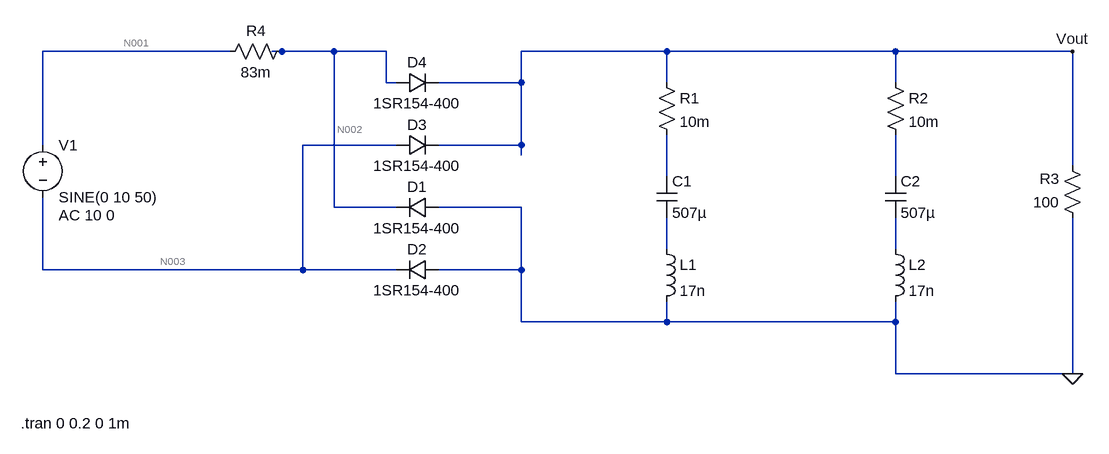
[diagram p0: schematic MuE_Set_1.asc]
MuE_Set_1.asc, the LTspice schematic file:
Version 4
SHEET 1 880 680
WIRE -576 -64 -864 -64
WIRE -496 -64 -512 -64
WIRE -416 -64 -496 -64
WIRE -336 -64 -416 -64
WIRE 96 -64 -128 -64
WIRE 448 -64 96 -64
WIRE 720 -64 448 -64
WIRE -336 -16 -336 -64
WIRE -320 -16 -336 -16
WIRE -128 -16 -128 -64
WIRE -128 -16 -256 -16
WIRE 96 -16 96 -64
WIRE 448 -16 448 -64
WIRE -864 80 -864 -64
WIRE -320 80 -464 80
WIRE -128 80 -128 -16
WIRE -128 80 -256 80
WIRE -128 96 -128 80
WIRE 720 112 720 -64
WIRE 96 128 96 64
WIRE 448 128 448 64
WIRE -416 176 -416 -64
WIRE -320 176 -416 176
WIRE -128 176 -256 176
WIRE 96 240 96 192
WIRE 448 240 448 192
WIRE -864 272 -864 160
WIRE -464 272 -464 80
WIRE -464 272 -864 272
WIRE -320 272 -464 272
WIRE -128 272 -128 176
WIRE -128 272 -256 272
WIRE -128 352 -128 272
WIRE 96 352 96 320
WIRE 96 352 -128 352
WIRE 448 352 448 320
WIRE 448 352 96 352
WIRE 448 432 448 352
WIRE 720 432 720 192
WIRE 720 432 448 432
FLAG 720 432 0
FLAG 720 -64 Vout
SYMBOL voltage -864 64 R0
WINDOW 123 24 124 Left 2
WINDOW 39 0 0 Left 0
SYMATTR InstName V1
SYMATTR Value SINE(0 10 50)
SYMATTR Value2 AC 10 0
SYMBOL res 80 -32 R0
SYMATTR InstName R1
SYMATTR Value 10m
SYMBOL res 432 -32 R0
SYMATTR InstName R2
SYMATTR Value 10m
SYMBOL res 736 208 R180
WINDOW 0 36 76 Left 2
WINDOW 3 36 40 Left 2
SYMATTR InstName R3
SYMATTR Value 100
SYMBOL res -480 -80 R90
WINDOW 0 0 56 VBottom 2
WINDOW 3 32 56 VTop 2
SYMATTR InstName R4
SYMATTR Value 83m
SYMBOL cap 80 128 R0
SYMATTR InstName C1
SYMATTR Value 507µ
SYMBOL cap 432 128 R0
SYMATTR InstName C2
SYMATTR Value 507µ
SYMBOL ind 80 224 R0
SYMATTR InstName L1
SYMATTR Value 17n
SYMBOL ind 432 224 R0
SYMATTR InstName L2
SYMATTR Value 17n
SYMBOL diode -256 160 R90
WINDOW 0 0 32 VBottom 2
WINDOW 3 32 32 VTop 2
SYMATTR InstName D1
SYMATTR Value 1SR154-400
SYMBOL diode -256 256 R90
WINDOW 0 0 32 VBottom 2
WINDOW 3 32 32 VTop 2
SYMATTR InstName D2
SYMATTR Value 1SR154-400
SYMBOL diode -320 96 R270
WINDOW 0 32 32 VTop 2
WINDOW 3 0 32 VBottom 2
SYMATTR InstName D3
SYMATTR Value 1SR154-400
SYMBOL diode -320 0 R270
WINDOW 0 32 32 VTop 2
WINDOW 3 0 32 VBottom 2
SYMATTR InstName D4
SYMATTR Value 1SR154-400
TEXT -898 508 Left 2 !.tran 0 0.2 0 1m

The netlist it stands for:
* MuE_Set_1.asc
V1 N001 N003 SINE(0 10 50) AC 10 0
R1 Vout N004 10m
R2 Vout N005 10m
R3 0 Vout 100
R4 N002 N001 83m
C1 N004 N006 507µ
C2 N005 N007 507µ
L1 N006 0 17n
L2 N007 0 17n
D1 0 N002 1SR154-400
D2 0 N003 1SR154-400
D3 N003 Vout 1SR154-400
D4 N002 Vout 1SR154-400
.model D D
.lib standard.dio
.tran 0 0.2 0 1m
.backanno
.end

* Results of the author's LTspice run, read from the files saved beside the schematic
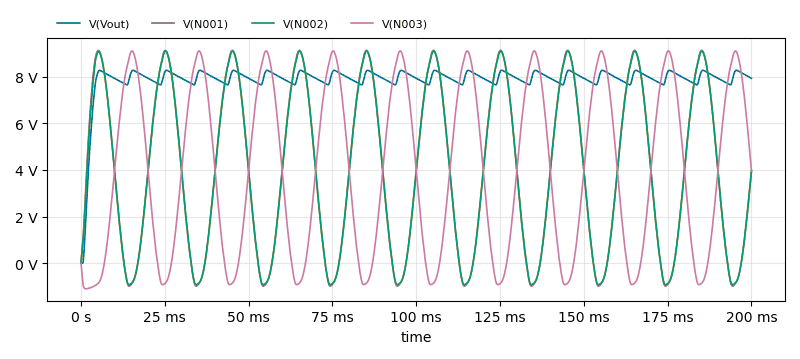
[diagram p1: Transient Analysis of MuE_Set_1.asc, plotted from the saved traces]
* Transient Analysis, 1 run:
*   V(Vout): min 0 V, max 8.277 V, average 7.88 V, rms 7.917 V, last 7.93 V
*   V(N001): min -982.6 mV, max 9.13 V, average 3.942 V, rms 5.309 V, last 3.965 V
*   V(N002): min -920.9 mV, max 9.101 V, average 3.938 V, rms 5.289 V, last 3.965 V
*   V(N003): min -1.102 V, max 9.108 V, average 3.942 V, rms 5.333 V, last 3.965 V